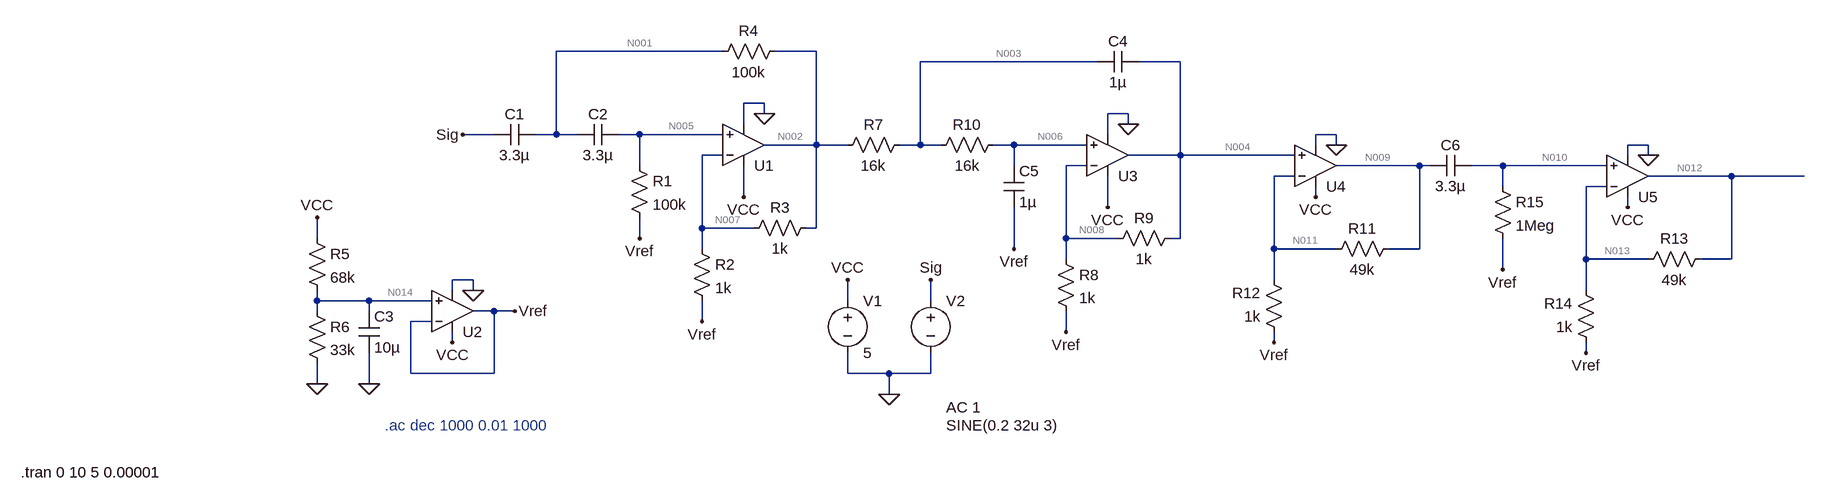
[diagram p0: schematic IF_amp_V3.asc]
IF_amp_V3.asc, the LTspice schematic file:
Version 4.1
SHEET 1 2788 680
WIRE 1120 -416 864 -416
WIRE 1264 -416 1200 -416
WIRE 1696 -400 1424 -400
WIRE 1824 -400 1760 -400
WIRE 1184 -336 1152 -336
WIRE 1184 -320 1184 -336
WIRE 1744 -320 1712 -320
WIRE 1152 -304 1152 -336
WIRE 1744 -304 1744 -320
WIRE 768 -288 720 -288
WIRE 864 -288 864 -416
WIRE 864 -288 832 -288
WIRE 896 -288 864 -288
WIRE 992 -288 960 -288
WIRE 1120 -288 992 -288
WIRE 1712 -288 1712 -320
WIRE 2064 -288 2032 -288
WIRE 1264 -272 1264 -416
WIRE 1264 -272 1184 -272
WIRE 1312 -272 1264 -272
WIRE 1424 -272 1424 -400
WIRE 1424 -272 1392 -272
WIRE 1456 -272 1424 -272
WIRE 1568 -272 1536 -272
WIRE 1680 -272 1568 -272
WIRE 2032 -272 2032 -288
WIRE 2064 -272 2064 -288
WIRE 2544 -272 2512 -272
WIRE 1120 -256 1088 -256
WIRE 1824 -256 1824 -400
WIRE 1824 -256 1744 -256
WIRE 2000 -256 1824 -256
WIRE 2512 -256 2512 -272
WIRE 2544 -256 2544 -272
WIRE 992 -240 992 -288
WIRE 1568 -240 1568 -272
WIRE 1680 -240 1648 -240
WIRE 2192 -240 2064 -240
WIRE 2208 -240 2192 -240
WIRE 2320 -240 2272 -240
WIRE 2480 -240 2320 -240
WIRE 2000 -224 1968 -224
WIRE 2672 -224 2544 -224
WIRE 2784 -224 2672 -224
WIRE 2320 -208 2320 -240
WIRE 2480 -208 2448 -208
WIRE 1152 -192 1152 -240
WIRE 2032 -192 2032 -208
WIRE 1712 -176 1712 -224
WIRE 2512 -176 2512 -192
WIRE 1088 -144 1088 -256
WIRE 1168 -144 1088 -144
WIRE 1264 -144 1264 -272
WIRE 1264 -144 1248 -144
WIRE 496 -128 496 -160
WIRE 992 -128 992 -160
WIRE 1648 -128 1648 -240
WIRE 1728 -128 1648 -128
WIRE 1824 -128 1824 -256
WIRE 1824 -128 1808 -128
WIRE 1088 -112 1088 -144
WIRE 1568 -112 1568 -176
WIRE 1968 -112 1968 -224
WIRE 2064 -112 1968 -112
WIRE 2192 -112 2192 -240
WIRE 2192 -112 2144 -112
WIRE 1648 -96 1648 -128
WIRE 2448 -96 2448 -208
WIRE 2544 -96 2448 -96
WIRE 2672 -96 2672 -224
WIRE 2672 -96 2624 -96
WIRE 2320 -80 2320 -128
WIRE 736 -64 704 -64
WIRE 1968 -64 1968 -112
WIRE 704 -48 704 -64
WIRE 736 -48 736 -64
WIRE 2448 -48 2448 -96
WIRE 496 -32 496 -48
WIRE 576 -32 496 -32
WIRE 672 -32 576 -32
WIRE 1312 -32 1312 -64
WIRE 1440 -32 1440 -64
WIRE 496 -16 496 -32
WIRE 576 -16 576 -32
WIRE 768 -16 736 -16
WIRE 800 -16 768 -16
WIRE 672 0 640 0
WIRE 1088 0 1088 -32
WIRE 1648 16 1648 -16
WIRE 704 32 704 16
WIRE 1968 32 1968 16
WIRE 2448 48 2448 32
WIRE 640 80 640 0
WIRE 768 80 768 -16
WIRE 768 80 640 80
WIRE 1312 80 1312 48
WIRE 1376 80 1312 80
WIRE 1440 80 1440 48
WIRE 1440 80 1376 80
WIRE 496 96 496 64
WIRE 576 96 576 48
WIRE 1376 112 1376 80
FLAG 1376 112 0
FLAG 1312 -64 VCC
FLAG 1440 -64 Sig
FLAG 720 -288 Sig
FLAG 1184 -320 0
FLAG 1152 -192 VCC
FLAG 736 -48 0
FLAG 704 32 VCC
FLAG 576 96 0
FLAG 496 96 0
FLAG 496 -160 VCC
FLAG 800 -16 Vref
FLAG 992 -128 Vref
FLAG 1088 0 Vref
FLAG 1744 -304 0
FLAG 1712 -176 VCC
FLAG 1568 -112 Vref
FLAG 1648 16 Vref
FLAG 2064 -272 0
FLAG 2032 -192 VCC
FLAG 1968 32 Vref
FLAG 2544 -256 0
FLAG 2512 -176 VCC
FLAG 2448 48 Vref
FLAG 2320 -80 Vref
SYMBOL voltage 1312 -48 R0
WINDOW 123 0 0 Left 0
WINDOW 39 0 0 Left 0
SYMATTR InstName V1
SYMATTR Value 5
SYMBOL voltage 1440 -48 R0
WINDOW 3 24 208 Left 2
WINDOW 123 24 180 Left 2
WINDOW 39 0 0 Left 0
SYMATTR Value SINE(0.2 32u 3)
SYMATTR Value2 AC 1
SYMATTR InstName V2
SYMBOL cap 832 -304 R90
WINDOW 0 0 32 VBottom 2
WINDOW 3 32 32 VTop 2
SYMATTR InstName C1
SYMATTR Value 3.3µ
SYMBOL cap 960 -304 R90
WINDOW 0 0 32 VBottom 2
WINDOW 3 32 32 VTop 2
SYMATTR InstName C2
SYMATTR Value 3.3µ
SYMBOL res 976 -256 R0
SYMATTR InstName R1
SYMATTR Value 100k
SYMBOL OpAmps\\UniversalOpAmp2 1152 -272 M180
SYMATTR InstName U1
SYMBOL res 1072 -128 R0
SYMATTR InstName R2
SYMATTR Value 1k
SYMBOL res 1264 -160 R90
WINDOW 0 0 56 VBottom 2
WINDOW 3 32 56 VTop 2
SYMATTR InstName R3
SYMATTR Value 1k
SYMBOL res 1216 -432 R90
WINDOW 0 0 56 VBottom 2
WINDOW 3 32 56 VTop 2
SYMATTR InstName R4
SYMATTR Value 100k
SYMBOL res 480 -144 R0
SYMATTR InstName R5
SYMATTR Value 68k
SYMBOL res 480 -32 R0
SYMATTR InstName R6
SYMATTR Value 33k
SYMBOL cap 560 -16 R0
SYMATTR InstName C3
SYMATTR Value 10µ
SYMBOL OpAmps\\UniversalOpAmp2 704 -16 M180
SYMATTR InstName U2
SYMBOL OpAmps\\UniversalOpAmp2 1712 -256 M180
SYMATTR InstName U3
SYMBOL res 1632 -112 R0
SYMATTR InstName R8
SYMATTR Value 1k
SYMBOL res 1824 -144 R90
WINDOW 0 0 56 VBottom 2
WINDOW 3 32 56 VTop 2
SYMATTR InstName R9
SYMATTR Value 1k
SYMBOL res 1408 -288 R90
WINDOW 0 0 56 VBottom 2
WINDOW 3 32 56 VTop 2
SYMATTR InstName R7
SYMATTR Value 16k
SYMBOL res 1552 -288 R90
WINDOW 0 0 56 VBottom 2
WINDOW 3 32 56 VTop 2
SYMATTR InstName R10
SYMATTR Value 16k
SYMBOL cap 1760 -416 R90
WINDOW 0 0 32 VBottom 2
WINDOW 3 32 32 VTop 2
SYMATTR InstName C4
SYMATTR Value 1µ
SYMBOL cap 1552 -240 R0
SYMATTR InstName C5
SYMATTR Value 1µ
SYMBOL OpAmps\\UniversalOpAmp2 2032 -240 M180
SYMATTR InstName U4
SYMBOL res 2160 -128 R90
WINDOW 0 0 56 VBottom 2
WINDOW 3 32 56 VTop 2
SYMATTR InstName R11
SYMATTR Value 49k
SYMBOL res 1984 32 R180
WINDOW 0 36 76 Left 2
WINDOW 3 36 40 Left 2
SYMATTR InstName R12
SYMATTR Value 1k
SYMBOL OpAmps\\UniversalOpAmp2 2512 -224 M180
SYMATTR InstName U5
SYMBOL res 2640 -112 R90
WINDOW 0 0 56 VBottom 2
WINDOW 3 32 56 VTop 2
SYMATTR InstName R13
SYMATTR Value 49k
SYMBOL res 2464 48 R180
WINDOW 0 36 76 Left 2
WINDOW 3 36 40 Left 2
SYMATTR InstName R14
SYMATTR Value 1k
SYMBOL cap 2272 -256 R90
WINDOW 0 0 32 VBottom 2
WINDOW 3 32 32 VTop 2
SYMATTR InstName C6
SYMATTR Value 3.3µ
SYMBOL res 2304 -224 R0
SYMATTR InstName R15
SYMATTR Value 1Meg
TEXT 40 232 Left 2 !.tran 0 10 5 0.00001
TEXT 600 160 Left 2 ;.ac dec 1000 0.01 1000

The netlist it stands for:
* IF_amp_V3.asc
V1 VCC 0 5
V2 Sig 0 SINE(0.2 32u 3) AC 1
C1 N001 Sig 3.3µ
C2 N005 N001 3.3µ
R1 N005 Vref 100k
X§U1 N005 N007 VCC 0 N002 level2 Avol=1Meg GBW=10Meg Slew=10Meg Ilimit=25m Rail=0 Vos=0 En=0 Enk=0 In=0 Ink=0 Rin=500Meg  ; pins In+ In- V+ V- OUT
R2 N007 Vref 1k
R3 N002 N007 1k
R4 N002 N001 100k
R5 VCC N014 68k
R6 N014 0 33k
C3 N014 0 10µ
X§U2 N014 Vref VCC 0 Vref level2 Avol=1Meg GBW=10Meg Slew=10Meg Ilimit=25m Rail=0 Vos=0 En=0 Enk=0 In=0 Ink=0 Rin=500Meg  ; pins In+ In- V+ V- OUT
X§U3 N006 N008 VCC 0 N004 level2 Avol=1Meg GBW=10Meg Slew=10Meg Ilimit=25m Rail=0 Vos=0 En=0 Enk=0 In=0 Ink=0 Rin=500Meg  ; pins In+ In- V+ V- OUT
R8 N008 Vref 1k
R9 N004 N008 1k
R7 N003 N002 16k
R10 N006 N003 16k
C4 N004 N003 1µ
C5 N006 Vref 1µ
X§U4 N004 N011 VCC 0 N009 level2 Avol=1Meg GBW=10Meg Slew=10Meg Ilimit=25m Rail=0 Vos=0 En=0 Enk=0 In=0 Ink=0 Rin=500Meg  ; pins In+ In- V+ V- OUT
R11 N009 N011 49k
R12 Vref N011 1k
X§U5 N010 N013 VCC 0 N012 level2 Avol=1Meg GBW=10Meg Slew=10Meg Ilimit=25m Rail=0 Vos=0 En=0 Enk=0 In=0 Ink=0 Rin=500Meg  ; pins In+ In- V+ V- OUT
R13 N012 N013 49k
R14 Vref N013 1k
C6 N010 N009 3.3µ
R15 N010 Vref 1Meg
.tran 0 10 5 0.00001
* .ac dec 1000 0.01 1000
.lib UniversalOpAmp2.lib
.backanno
.end

* Results of the author's LTspice run, read from the files saved beside the schematic
* Operating Point, zero values left out:
*   V(n001) = 1.634 V
*   V(n002) = 1.634 V
*   V(n003) = 1.634 V
*   V(n004) = 1.635 V
*   V(n005) = 1.634 V
*   V(n006) = 1.634 V
*   V(n007) = 1.634 V
*   V(n008) = 1.634 V
*   V(n009) = 1.674 V
*   V(n010) = 1.635 V
*   V(n011) = 1.635 V
*   V(n012) = 1.72 V
*   V(n013) = 1.635 V
*   V(n014) = 1.634 V
*   V(sig) = 200 mV
*   V(vcc) = 5 V
*   V(vref) = 1.634 V
*   I(R1) = 1.732 nA
*   I(R10) = 1.732 nA
*   I(R11) = 802.9 nA
*   I(R12) = -804.6 nA
*   I(R13) = 1.728 µA
*   I(R14) = -1.73 µA
*   I(R15) = 1.729 nA
*   I(R2) = 174.1 nA
*   I(R3) = 172.4 nA
*   I(R5) = 49.5 µA
*   I(R6) = 49.51 µA
*   I(R7) = 1.732 nA
*   I(R8) = 402.8 nA
*   I(R9) = 401 nA
*   I(V1) = -1.227 mA